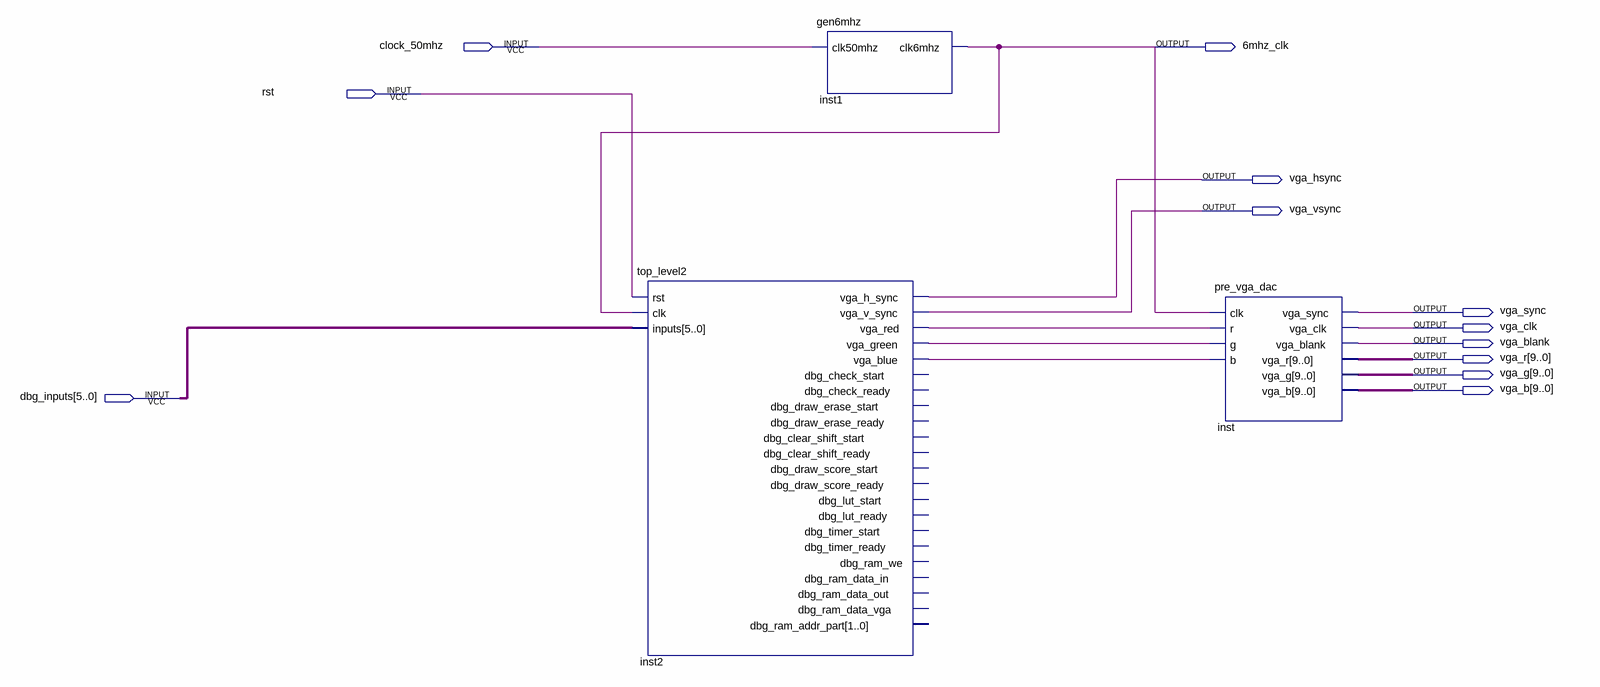
[diagram p0: schematic sheet]
// Quartus schematic top_de2.bdf as structural Verilog: 3 symbols, 12 pins
module top_de2 (
  input  clock_50mhz,
  input  rst,
  input  [5:0] dbg_inputs,
  output \6mhz_clk ,
  output vga_hsync,
  output vga_vsync,
  output vga_sync,
  output vga_clk,
  output vga_blank,
  output [9:0] vga_r,
  output [9:0] vga_g,
  output [9:0] vga_b
);

  wire inst2_vga_blue, inst2_vga_green, inst2_vga_red;

  top_level2 inst2 (
    .rst(rst), .clk(\6mhz_clk ), .inputs(dbg_inputs), .vga_h_sync(vga_hsync), .vga_v_sync(vga_vsync),
    .vga_red(inst2_vga_red), .vga_green(inst2_vga_green), .vga_blue(inst2_vga_blue));  // open: dbg_check_start, dbg_check_ready, dbg_draw_erase_start, dbg_draw_erase_ready, dbg_clear_shift_start, dbg_clear_shift_ready, dbg_draw_score_start, dbg_draw_score_ready, dbg_lut_start, dbg_lut_ready, dbg_timer_start, dbg_timer_ready, dbg_ram_we, dbg_ram_data_in, dbg_ram_data_out, dbg_ram_data_vga, dbg_ram_addr_part
  gen6mhz inst1 (.clk50mhz(clock_50mhz), .clk6mhz(\6mhz_clk ));
  pre_vga_dac inst (
    .clk(\6mhz_clk ), .r(inst2_vga_red), .g(inst2_vga_green), .b(inst2_vga_blue), .vga_sync(vga_sync),
    .vga_clk(vga_clk), .vga_blank(vga_blank), .vga_r(vga_r), .vga_g(vga_g), .vga_b(vga_b));
endmodule
